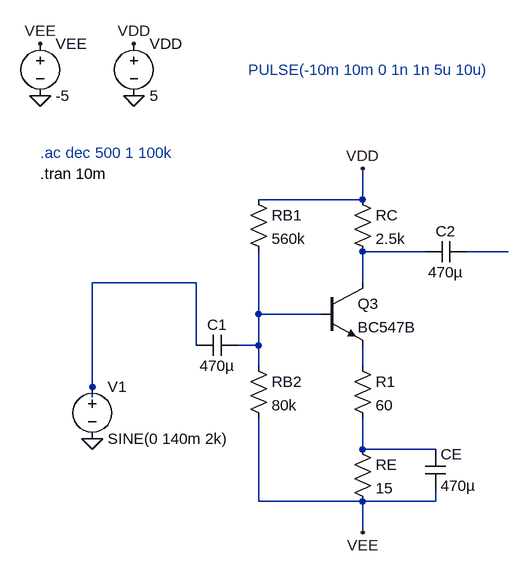
[diagram p0: schematic stage2.asc]
stage2.asc, the LTspice schematic file:
Version 4
SHEET 1 2216 736
WIRE 144 -32 144 -80
WIRE 144 -32 -16 -32
WIRE 240 48 144 48
WIRE 368 48 304 48
WIRE -112 96 -272 96
WIRE 144 96 144 48
WIRE -16 144 -16 48
WIRE 80 144 -16 144
WIRE -112 192 -112 96
WIRE -16 192 -16 144
WIRE -16 192 -48 192
WIRE -16 224 -16 192
WIRE 144 224 144 192
WIRE -272 256 -272 96
WIRE -272 272 -272 256
WIRE 144 352 144 304
WIRE 256 352 144 352
WIRE -16 432 -16 304
WIRE 144 432 -16 432
WIRE 256 432 256 416
WIRE 256 432 144 432
WIRE 144 480 144 432
FLAG 144 -80 VDD
FLAG -352 -192 0
FLAG -352 -272 VEE
FLAG 144 480 VEE
FLAG -208 -272 VDD
FLAG -208 -192 0
FLAG -272 336 0
DATAFLAG 144 432 ""
DATAFLAG 208 48 ""
DATAFLAG -16 112 ""
DATAFLAG 144 224 ""
SYMBOL npn 80 96 R0
SYMATTR InstName Q3
SYMATTR Value BC547B
SYMBOL res 128 336 R0
SYMATTR InstName RE
SYMATTR Value 15
SYMBOL cap 240 352 R0
SYMATTR InstName CE
SYMATTR Value 470µ
SYMBOL res -32 208 R0
SYMATTR InstName RB2
SYMATTR Value 80k
SYMBOL cap -48 176 R90
WINDOW 0 0 32 VBottom 2
WINDOW 3 32 32 VTop 2
SYMATTR InstName C1
SYMATTR Value 470µ
SYMBOL res -32 -48 R0
SYMATTR InstName RB1
SYMATTR Value 560k
SYMBOL res 128 -48 R0
SYMATTR InstName RC
SYMATTR Value 2.5k
SYMBOL cap 304 32 R90
WINDOW 0 0 32 VBottom 2
WINDOW 3 32 32 VTop 2
SYMATTR InstName C2
SYMATTR Value 470µ
SYMBOL voltage -352 -288 R0
WINDOW 123 0 0 Left 0
WINDOW 39 0 0 Left 0
SYMATTR InstName VEE
SYMATTR Value -5
SYMBOL voltage -208 -288 R0
WINDOW 123 0 0 Left 0
WINDOW 39 0 0 Left 0
SYMATTR InstName VDD
SYMATTR Value 5
SYMBOL res 128 208 R0
SYMATTR InstName R1
SYMATTR Value 60
SYMBOL voltage -272 240 R0
WINDOW 123 0 0 Left 0
WINDOW 39 0 0 Left 0
SYMATTR InstName V1
SYMATTR Value SINE(0 140m 2k)
TEXT -352 -104 Left 2 ;.ac dec 500 1 100k
TEXT -352 -72 Left 2 !.tran 10m
TEXT -32 -232 Left 2 ;PULSE(-10m 10m 0 1n 1n 5u 10u)

The netlist it stands for:
* stage2.asc
Q3 N001 N004 N005 0 BC547B
RE N006 VEE 15
CE N006 VEE 470µ
RB2 N004 VEE 80k
C1 N004 N003 470µ
RB1 VDD N004 560k
RC VDD N001 2.5k
C2 N002 N001 470µ
VEE VEE 0 -5
VDD VDD 0 5
R1 N005 N006 60
V1 N003 0 SINE(0 140m 2k)
.model NPN NPN
.model PNP PNP
.lib standard.bjt
* .ac dec 500 1 100k
.tran 10m
* PULSE(-10m 10m 0 1n 1n 5u 10u)
.backanno
.end